# Altium schematic sheet 09.SchDoc
size 513 x 386 mm
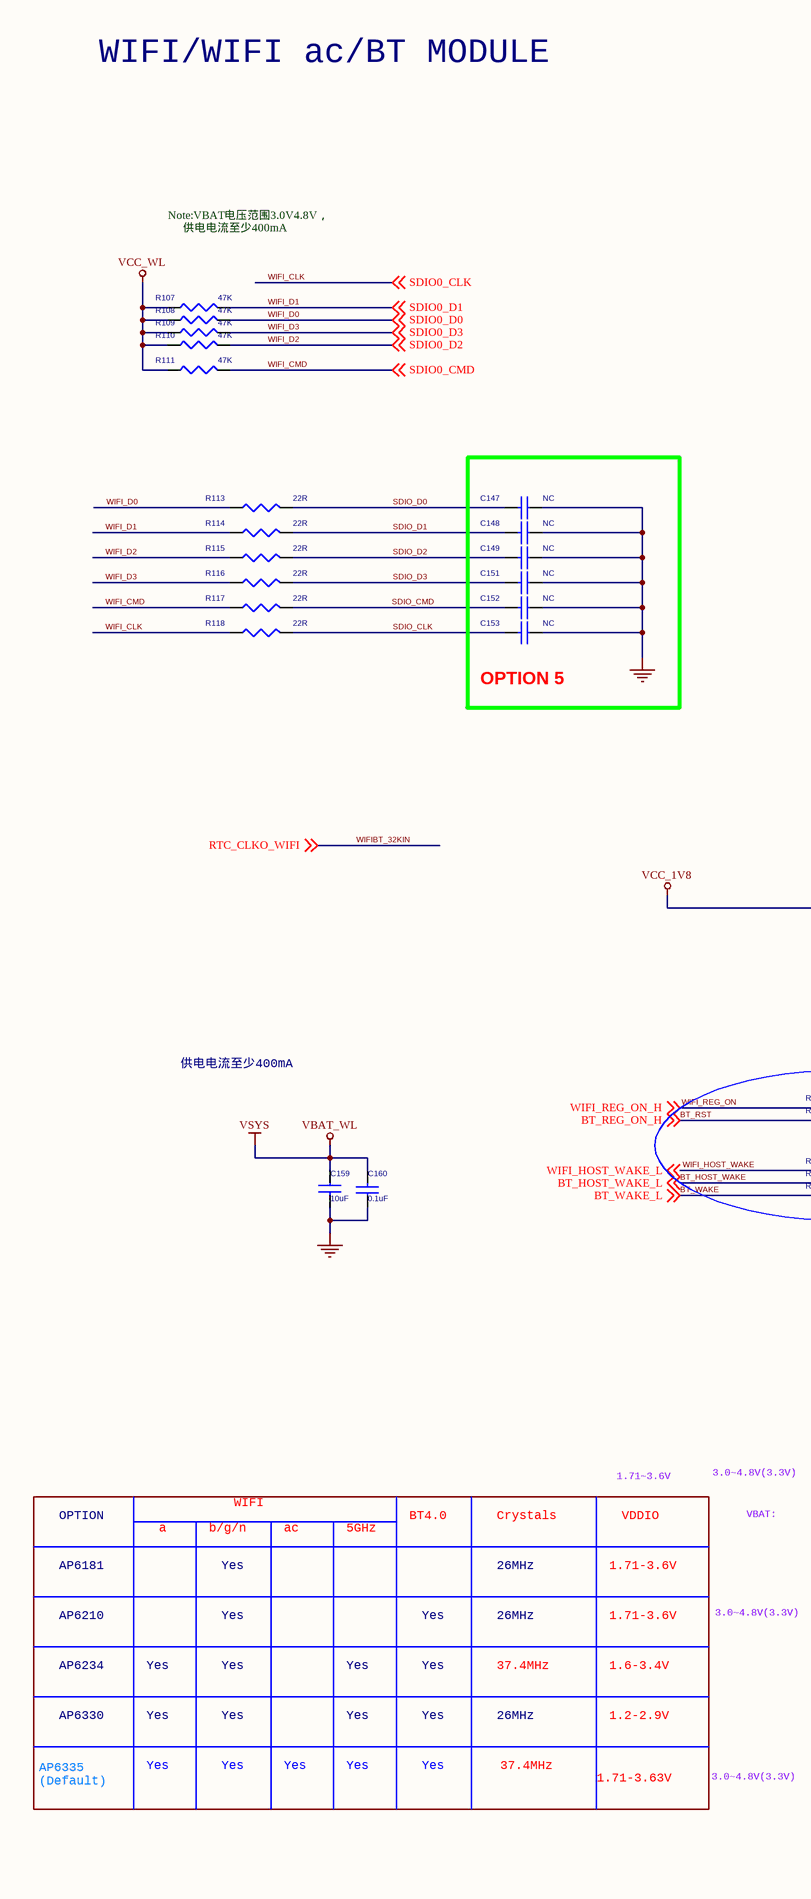
[diagram p0: 09.SchDoc, left]
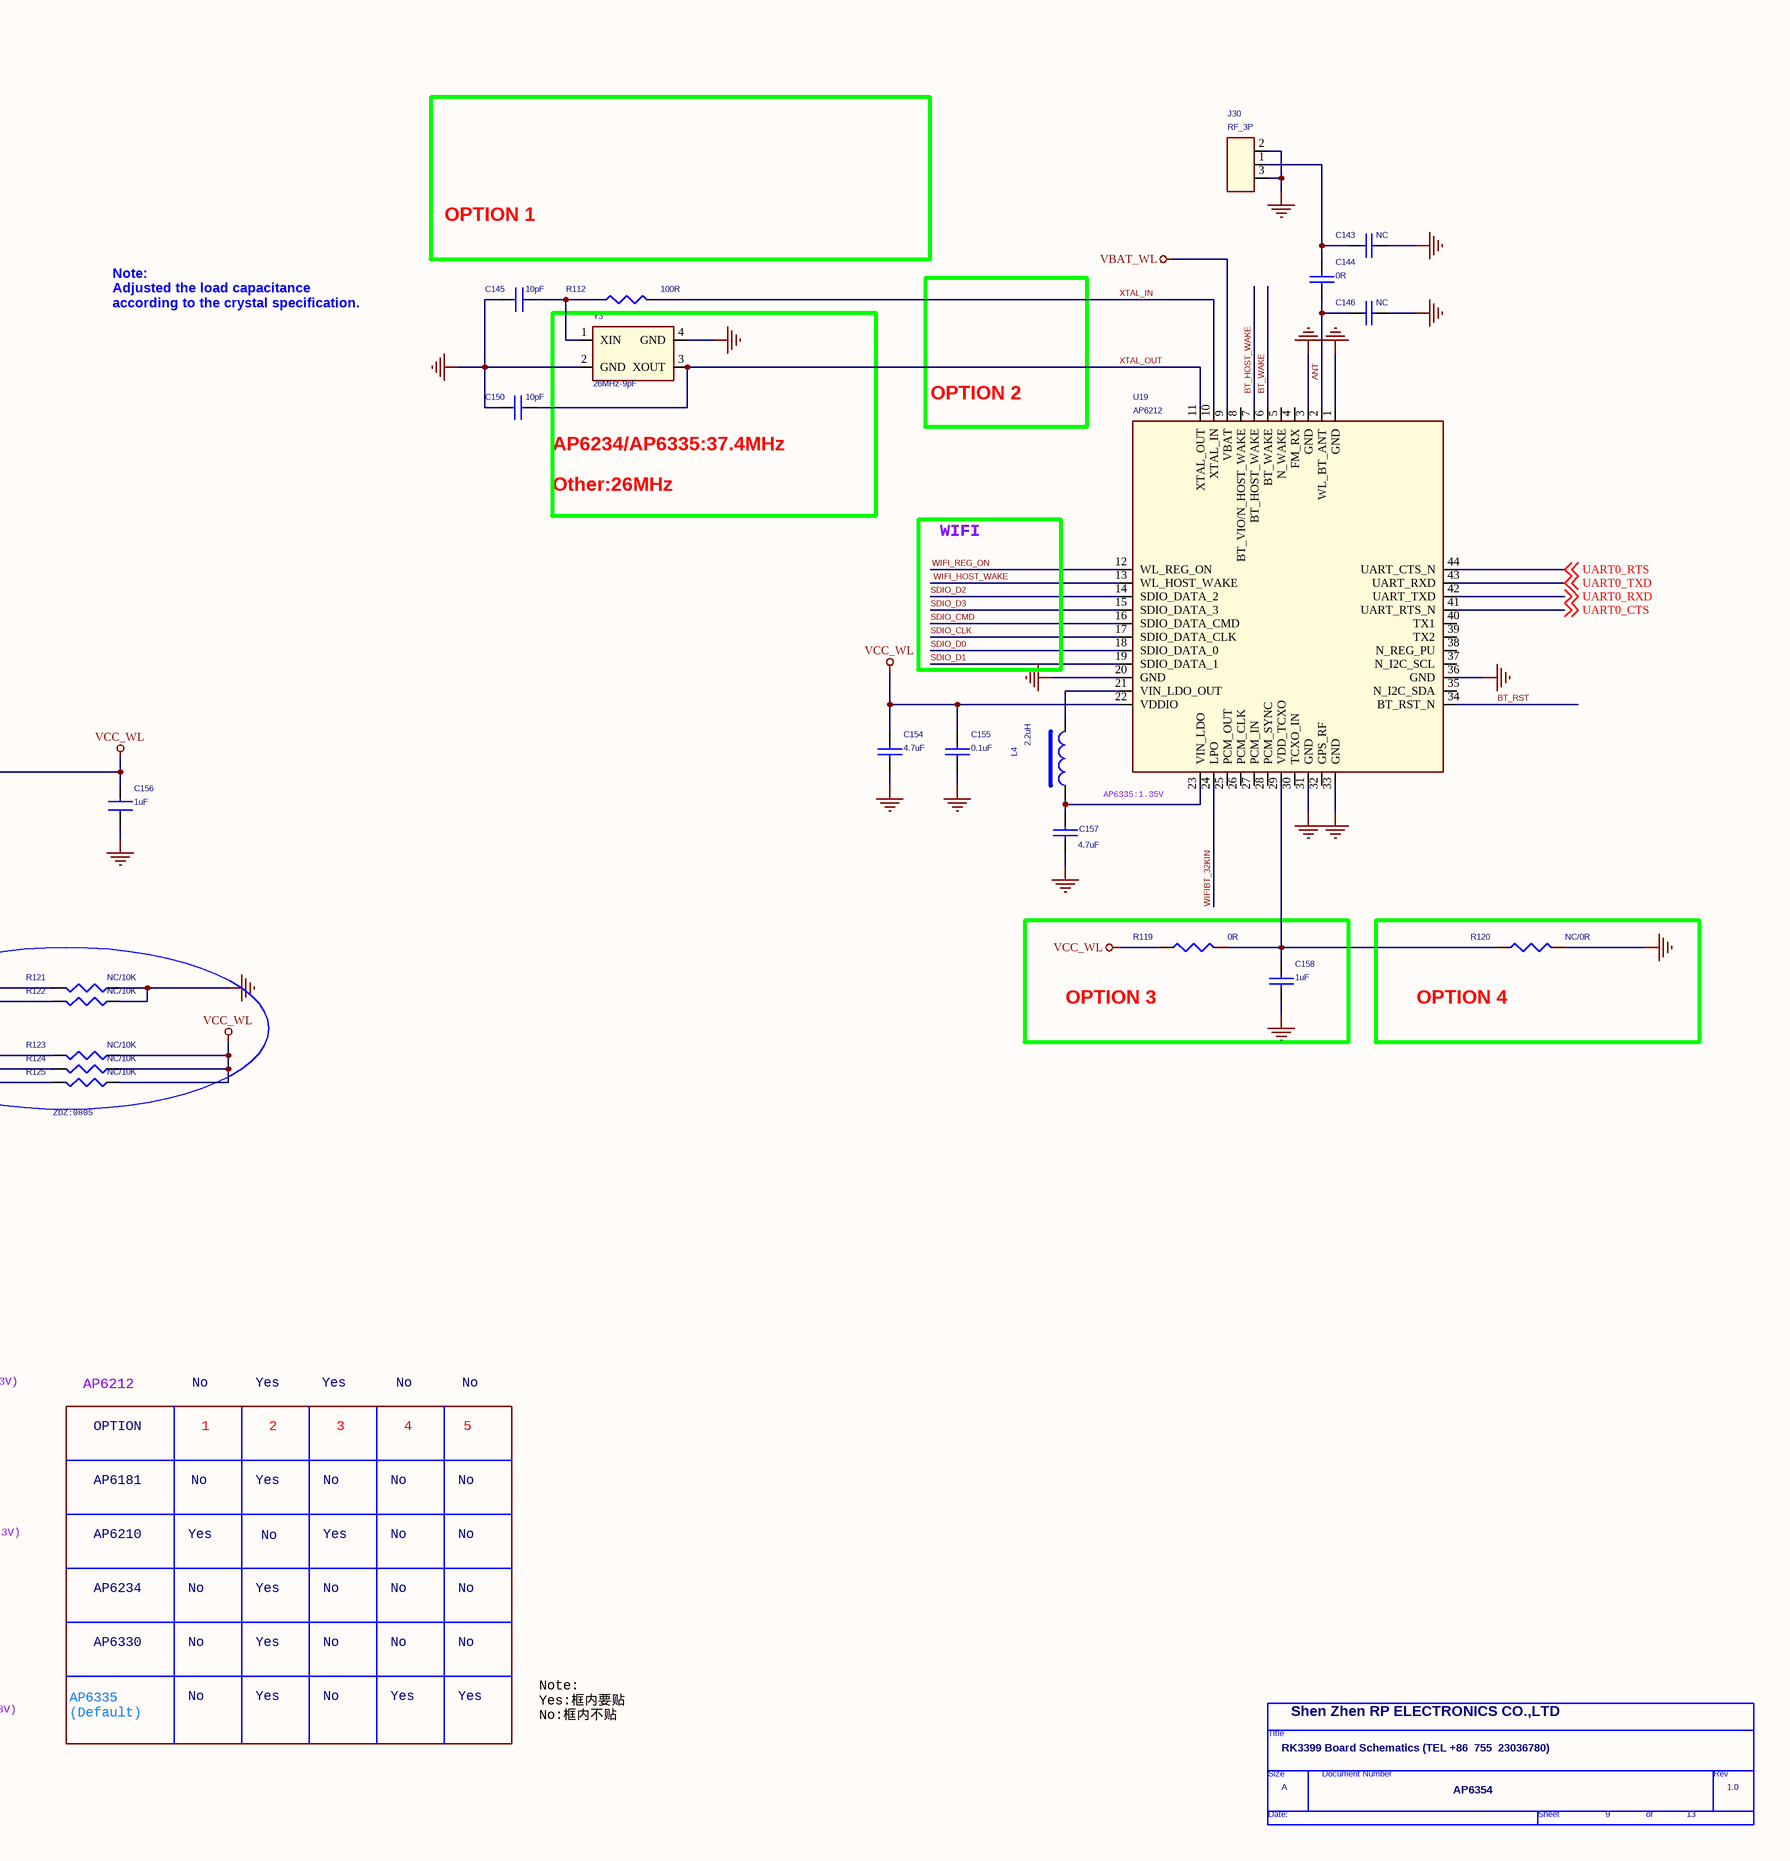
[diagram p1: 09.SchDoc, right]

## Parts
*  Doc: AP6354  RevCode: 1.0  Title: RK3399 Board Schematics (TEL +86  755  23036780)  Page Size: A  Page Number: 9  Page Count: 13  Cage Code: Shen Zhen RP ELECTRONICS CO.,LTD  (hidden comment: TitleBlock0)  (graphical)
C143  NC  [0805C]
C144  0R  [0805C]
C145  10pF  [0805C]
C146  NC  [0805C]
C147  NC  [0805C]
C148  NC  [0805C]
C149  NC  [0805C]
C150  10pF  [0805C]
C151  NC  [0805C]
C152  NC  [0805C]
C153  NC  [0805C]
C154  4.7uF  [0805C]
C155  0.1uF  [0805C]
C156  1uF  [0805C]
C157  4.7uF  [0805C]
C158  1uF  [0805C]
C159  10uF  [0805C]
C160  0.1uF  [0805C]
J30  RF_3P  [ANT-2]
L4  2.2uH  [IND2520]
R107  47K  [0805]
R108  47K  [0805]
R109  47K  [0805]
R110  47K  [0805]
R111  47K  [0805]
R112  100R  [0805]
R113  22R  [0805]
R114  22R  [0805]
R115  22R  [0805]
R116  22R  [0805]
R117  22R  [0805]
R118  22R  [0805]
R119  0R  [0805]
R120  NC/0R  [0805]
R121  NC/10K  [0805]
R122  NC/10K  [0805]
R123  NC/10K  [0805]
R124  NC/10K  [0805]
R125  NC/10K  [0805]
U19  AP6212  [AP6XXX]
Y3  26MHz-9pF  [CRY-3225]

## Blocks framed on the sheet
OPTION 5: C147-C149 C151-C153
OPTION 3: C158 R119
OPTION 4: R120

## Nets
GND: C143.2 C145.2 C146.2 C147.1 C148.1 C149.1 C150.1 C151.1 C152.1 C153.1 C154.1 C155.1 C156.2 C157.1 C158.1 C159.2 C160.1 J30.2 J30.3 R120.1 R121.1 R122.1 U19.1(GND) U19.3(GND) U19.20(GND) U19.31(GND) U19.33(GND) U19.36(GND) Y3.2(GND) Y3.4(GND)
VBAT_WL: C159.1 C160.2 U19.9(VBAT)  [also labelled VSYS]
VCC_1V8: C154.2 C155.2 C156.1 R107.1 R108.1 R109.1 R110.1 R111.1 R119.2 R123.1 R124.1 R125.1 U19.22(VDDIO)  [also labelled VCC_WL]
ANT: C144.1 C146.1 U19.2(WL_BT_ANT)
BT_HOST_WAKE: R124.2 U19.7(BT_HOST_WAKE) ; off-sheet BT_HOST_WAKE_L  [also labelled BT_HOST_WAKE_L]
BT_RST: R122.2 U19.34(BT_RST_N) ; off-sheet BT_REG_ON_H  [also labelled BT_REG_ON_H]
BT_WAKE: R125.2 U19.6(BT_WAKE) ; off-sheet BT_WAKE_L  [also labelled BT_WAKE_L]
SDIO_CLK: C153.2 R118.2 U19.17(SDIO_DATA_CLK)
SDIO_CMD: C152.2 R117.2 U19.16(SDIO_DATA_CMD)
SDIO_D0: C147.2 R113.2 U19.18(SDIO_DATA_0)
SDIO_D1: C148.2 R114.2 U19.19(SDIO_DATA_1)
SDIO_D2: C149.2 R115.2 U19.14(SDIO_DATA_2)
SDIO_D3: C151.2 R116.2 U19.15(SDIO_DATA_3)
UART0_CTS: U19.41(UART_RTS_N) ; off-sheet UART0_CTS
UART0_RTS: U19.44(UART_CTS_N) ; off-sheet UART0_RTS
UART0_RXD: U19.42(UART_TXD) ; off-sheet UART0_RXD
UART0_TXD: U19.43(UART_RXD) ; off-sheet UART0_TXD
WIFI_CLK: R118.1 ; off-sheet SDIO0_CLK  [also labelled SDIO0_CLK]
WIFI_CMD: R111.2 R117.1 ; off-sheet SDIO0_CMD  [also labelled SDIO0_CMD]
WIFI_D0: R108.2 R113.1 ; off-sheet SDIO0_D0  [also labelled SDIO0_D0]
WIFI_D1: R107.2 R114.1 ; off-sheet SDIO0_D1  [also labelled SDIO0_D1]
WIFI_D2: R110.2 R115.1 ; off-sheet SDIO0_D2  [also labelled SDIO0_D2]
WIFI_D3: R109.2 R116.1 ; off-sheet SDIO0_D3  [also labelled SDIO0_D3]
WIFI_HOST_WAKE: R123.2 U19.13(WL_HOST_WAKE) ; off-sheet WIFI_HOST_WAKE_L  [also labelled WIFI_HOST_WAKE_L]
WIFI_REG_ON: R121.2 U19.12(WL_REG_ON) ; off-sheet WIFI_REG_ON_H  [also labelled WIFI_REG_ON_H]
WIFIBT_32KIN: U19.24(LPO) ; off-sheet RTC_CLKO_WIFI  [also labelled RTC_CLKO_WIFI]
XTAL_IN: R112.2 U19.10(XTAL_IN)
XTAL_OUT: C150.2 U19.11(XTAL_OUT) Y3.3(XOUT)
NetC143_1: C143.1 C144.2 J30.1
NetC145_1: C145.1 R112.1 Y3.1(XIN)
NetC157_2: C157.2 L4.1 U19.23(VIN_LDO)
NetC158_2: C158.2 R119.1 R120.2 U19.29(VDD_TCXO)
NetL4_2: L4.2 U19.21(VIN_LDO_OUT)

Not connected (* = marked no-connect by the designer): U19 4(FM_RX) 5(N_WAKE) 8(BT_VIO/N_HOST_WAKE) 25(PCM_OUT) 26(PCM_CLK) 27(PCM_IN) 28(PCM_SYNC) 30(TCXO_IN) 32(GPS_RF) 35(N_I2C_SDA) 37(N_I2C_SCL) 38(N_REG_PU) 39(TX2) 40(TX1)

## Notes on the sheet
- WIFI/WIFI ac/BT MODULE
- Note:VBAT电压范围3.0V4.8V，
  供电电流至少400mA
- OPTION 1
- (near C145) Note:
  Adjusted the load capacitance
  according to the crystal specification.
- OPTION 2
- Other:26MHz
- (near C150) AP6234/AP6335:37.4MHz
- WIFI
- (near U19) AP6335:1.35V
- 供电电流至少400mA
- ZDZ:0805
- 1.71~3.6V
- 3.0~4.8V(3.3V)
- AP6212
- No
- Yes
- OPTION
- a
- b/g/n
- ac
- 5GHz
- BT4.0
- Crystals
- VDDIO
- VBAT:
- 1
- 2
- 3
- 4
- 5
- AP6181
- 26MHz
- 1.71-3.6V
- AP6234
- AP6210
- 37.4MHz
- 1.6-3.4V
- AP6330
- 1.2-2.9V
- AP6335
  (Default)
- 1.71-3.63V
- Note:
  Yes:框内要贴
  No:框内不贴
- (in symbol TitleBlock0) Title; Size; Document Number; Rev; Date:; Sheet; of

## Library data of the parts
C143 C144 C146 C154 C155 C157 C158 = CAPNP_Dup1_1
C145 C150 = CAP NP: CAP,MLCC,8pF,+/-0.5pF,NPO,6.3V,SMD0402
C147-C149 C151-C153 C160 = CAP NP: CAP,MLCC,100nF,+/-10%,X7R,6.3V,SMD0402; Supplier: MURATA; Supplier P/N: GRM21BR61C106K
C156 = CAP NP_Dup6: CAP,MLCC,100nF,+/-10%,X7R,6.3V,SMD0402
C159 = CAP NP: CAP,MLCC,4.7uF,+/-10%,X5R,6.3V,SMD0603; Supplier P/N: GRM21BR61C106K; Supplier: MURATA
J30 = CON3_1
L4 = INDUCTOR_1_Dup1: CoilInd,Shielded(SHLD),2.2uH@100KHz,+/-30%,1.09A,110mOhm,SMD,3.0*3.0*1.0; ROOM: USB+5V
R107-R111 = RESISTOR_Dup2: ROHS CHIP RES 10K 1/16W +/-5%
R112 = R_0
R113-R120 = RESISTOR_Dup2: RES,thick film,33Ohm,+/-5%,1/16W,SMD0402
R121-R125 = RESISTOR_1
U19 = AP6493_1: Device: AMPAK_SIP; QVL: AMPAK; ORCAD_LIB: MODULE
Y3 = CRYSTAL-4_4: Crystal,37.400MHz,+/-20ppm,12pF,SMD3225,-10°C ~ +60   °C
* = TitleBlock0: Page Create Date: March  8, 1995